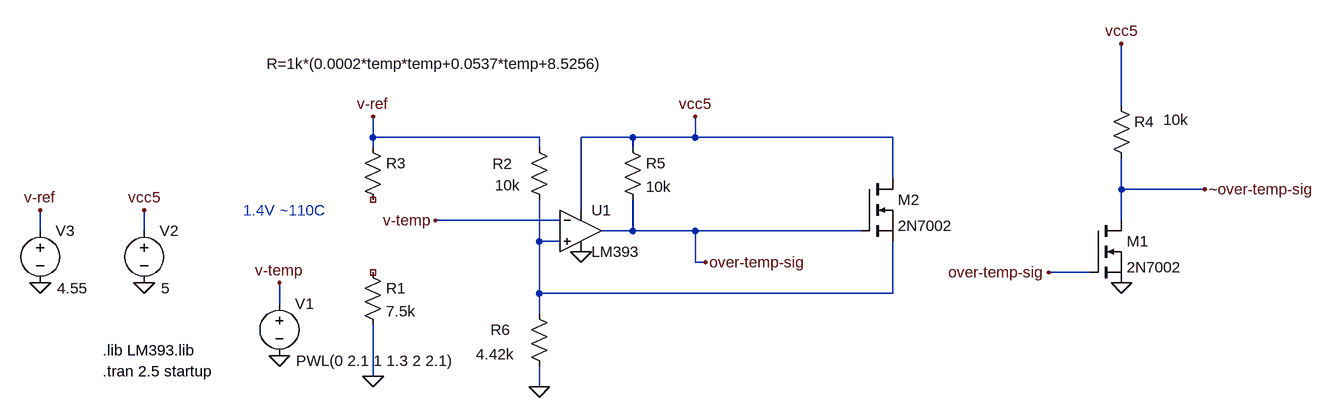
[diagram p0: schematic over-temp-latch.asc]
over-temp-latch.asc, the LTspice schematic file:
Version 4
SHEET 1 2052 680
WIRE 1104 -96 1104 -192
WIRE -48 -48 -48 -80
WIRE 208 -48 -48 -48
WIRE 352 -48 272 -48
WIRE 448 -48 448 -80
WIRE 448 -48 352 -48
WIRE 752 -48 448 -48
WIRE -48 -32 -48 -48
WIRE 208 -32 208 -48
WIRE 352 -32 352 -48
WIRE 752 16 752 -48
WIRE 1104 32 1104 -16
WIRE 1232 32 1104 32
WIRE 272 64 272 -48
WIRE 240 80 48 80
WIRE 1104 80 1104 32
WIRE -560 96 -560 64
WIRE -400 96 -400 64
WIRE 352 96 352 48
WIRE 352 96 304 96
WIRE 448 96 352 96
WIRE 704 96 448 96
WIRE 208 112 208 48
WIRE 240 112 208 112
WIRE 448 144 448 96
WIRE 464 144 448 144
WIRE 1056 160 992 160
WIRE 208 192 208 112
WIRE 752 192 752 112
WIRE 752 192 208 192
WIRE -192 208 -192 176
WIRE 208 224 208 192
WIRE -48 320 -48 240
WIRE 208 336 208 304
FLAG -400 176 0
FLAG -400 64 vcc5
FLAG -48 320 0
FLAG 272 128 0
FLAG 48 80 v-temp
FLAG -560 176 0
FLAG -560 64 v-ref
FLAG -48 -80 v-ref
FLAG 208 336 0
FLAG 464 144 over-temp-sig
FLAG -192 288 0
FLAG -192 176 v-temp
FLAG 1104 176 0
FLAG 1104 -192 vcc5
FLAG 448 -80 vcc5
FLAG 1232 32 ~over-temp-sig
FLAG 992 160 over-temp-sig
SYMBOL voltage -400 80 R0
WINDOW 3 26 104 Left 2
WINDOW 123 0 0 Left 0
WINDOW 39 0 0 Left 0
SYMATTR Value 5
SYMATTR InstName V2
SYMBOL res -64 144 R0
SYMATTR InstName R1
SYMATTR Value 7.5k
SYMBOL res -64 -48 R0
WINDOW 3 -148 -113 Left 2
SYMATTR Value R=1k*(0.0002*temp*temp+0.0537*temp+8.5256)
SYMATTR InstName R3
SYMBOL OpAmps\\opamp2 272 32 R0
SYMATTR InstName U1
SYMATTR Value LM393
SYMBOL res 336 -48 R0
SYMATTR InstName R5
SYMATTR Value 10k
SYMBOL voltage -560 80 R0
WINDOW 3 26 104 Left 2
WINDOW 123 0 0 Left 0
WINDOW 39 0 0 Left 0
SYMATTR Value 4.55
SYMATTR InstName V3
SYMBOL res 192 -48 R0
WINDOW 0 -56 41 Left 2
WINDOW 3 -52 74 Left 2
SYMATTR InstName R2
SYMATTR Value 10k
SYMBOL res 192 208 R0
WINDOW 0 -59 40 Left 2
WINDOW 3 -81 78 Left 2
SYMATTR InstName R6
SYMATTR Value 4.42k
SYMBOL voltage -192 192 R0
WINDOW 3 26 104 Left 2
WINDOW 123 0 0 Left 0
WINDOW 39 0 0 Left 0
SYMATTR Value PWL(0 2.1 1 1.3 2 2.1)
SYMATTR InstName V1
SYMBOL nmos 1056 80 R0
SYMATTR InstName M1
SYMATTR Value 2N7002
SYMBOL res 1088 -112 R0
WINDOW 3 80 37 Left 2
SYMATTR Value 10k
SYMATTR InstName R4
SYMBOL nmos 704 16 R0
SYMATTR InstName M2
SYMATTR Value 2N7002
TEXT -464 312 Left 2 !.tran 2.5 startup
TEXT -464 280 Left 2 !.lib LM393.lib
TEXT -248 64 Left 2 ;1.4V ~110C

The netlist it stands for:
* over-temp-latch.asc
V2 vcc5 0 5
R1 NC_01 0 7.5k
R3 v-ref NC_02 R=1k*(0.0002*temp*temp+0.0537*temp+8.5256)
XU1 N001 v-temp vcc5 0 over-temp-sig LM393  ; pins In+ In- V+ V- OUT
R5 vcc5 over-temp-sig 10k
V3 v-ref 0 4.55
R2 v-ref N001 10k
R6 N001 0 4.42k
V1 v-temp 0 PWL(0 2.1 1 1.3 2 2.1)
M1 ~over-temp-sig over-temp-sig 0 0 2N7002
R4 vcc5 ~over-temp-sig 10k
M2 vcc5 over-temp-sig N001 N001 2N7002
.model NMOS NMOS
.model PMOS PMOS
.lib standard.mos
.tran 2.5 startup
.lib LM393.lib
* 1.4V ~110C
.backanno
.end

* Results of the author's LTspice run, read from the files saved beside the schematic
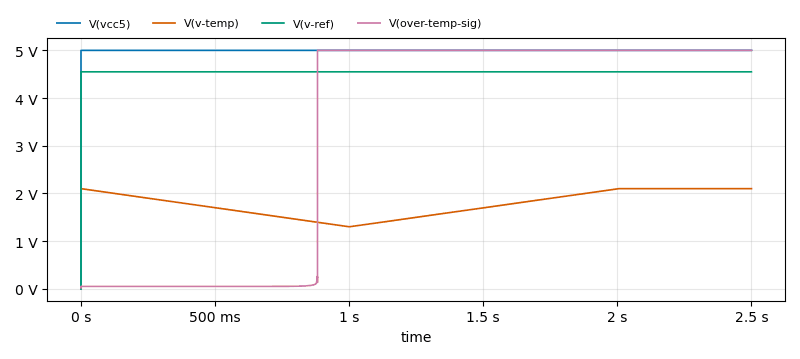
[diagram p1: Transient Analysis of over-temp-latch.asc, plotted from the saved traces]
* Transient Analysis, 1 run:
*   V(vcc5): min 0 V, max 5 V, average 5 V, rms 5 V, last 5 V
*   V(v-temp): min 1.3 V, max 2.1 V, average 1.779 V, rms 1.811 V, last 2.1 V
*   V(v-ref): min 0 V, max 4.55 V, average 4.55 V, rms 4.55 V, last 4.55 V
*   V(over-temp-sig): min 17.7 mV, max 5 V, average 3.255 V, rms 4.023 V, last 5 V